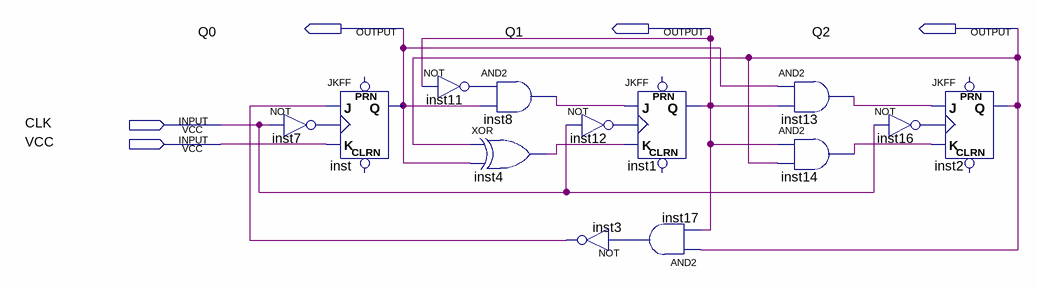
[diagram p0: schematic sheet]
// Quartus schematic 7counter.bdf as structural Verilog: 13 symbols, 5 pins
module \7counter  (
  input  CLK,
  input  VCC,
  output Q0,
  output Q1,
  output Q2
);

  wire inst3_out, inst4_out, inst7_out, inst8_out, inst11_out, inst12_out, inst13_out, inst14_out,
       inst16_out, inst17_out;

  not inst7 (inst7_out, CLK);
  JKFF inst (.K(VCC), .J(inst3_out), .CLK(inst7_out), .Q(Q0));  // open: PRN, CLRN
  not inst11 (inst11_out, Q1);
  and inst8 (inst8_out, inst11_out, Q0);
  xor inst4 (inst4_out, Q2, Q0);
  not inst12 (inst12_out, CLK);
  not inst3 (inst3_out, inst17_out);
  JKFF inst1 (.K(inst4_out), .J(inst8_out), .CLK(inst12_out), .Q(Q1));  // open: PRN, CLRN
  and inst17 (inst17_out, Q2, Q1);
  and inst13 (inst13_out, Q0, Q1);
  and inst14 (inst14_out, Q1, Q2);
  not inst16 (inst16_out, CLK);
  JKFF inst2 (.K(inst14_out), .J(inst13_out), .CLK(inst16_out), .Q(Q2));  // open: PRN, CLRN
endmodule
